# Altium schematic sheet LTE_SARA-R422-00B.SchDoc
size A4; SheetNumber: 2; SheetTotal: 10
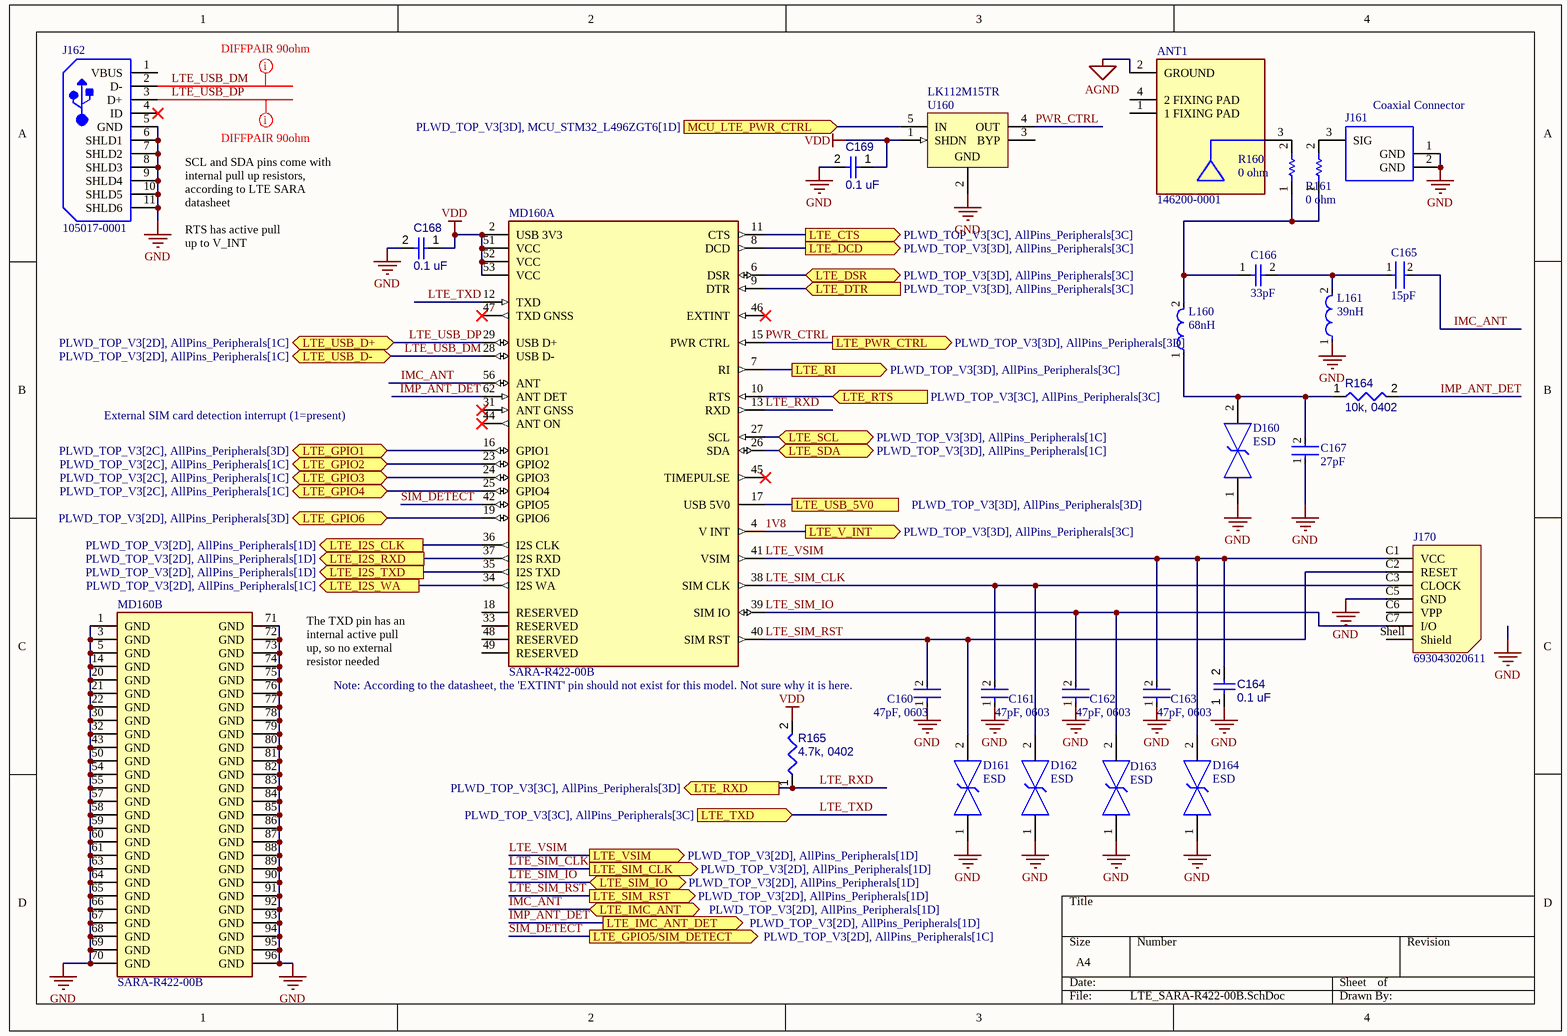
[diagram p0: LTE_SARA-R422-00B.SchDoc]

## Parts
ANT1  146200-0001  [FP-146200-0001-MFG]
C160  47pF, 0603  [FP-C0603C-CF-MFG]
C161  47pF, 0603  [FP-C0603C-CF-MFG]
C162  47pF, 0603  [FP-C0603C-CF-MFG]
C163  47pF, 0603  [FP-C0603C-CF-MFG]
C164  0.1 uF  [CAPC1005X56X25LL10T15]
C165  15pF  [FP-0603-L_1_6_0_15-W_0_81-IPC_B]
C166  33pF  [CAPC1608X90X35NL15T15]
C167  27pF  [FP-C0603C-CF-MFG]
C168  0.1 uF  [CAPC1005X56X25LL10T15]
C169  0.1 uF  [CAPC1005X56X25LL10T15]
D160  ESD  [FP-PG-TSSLP-2-MFG]
D161  ESD  [FP-PG-TSSLP-2-MFG]
D162  ESD  [FP-PG-TSSLP-2-MFG]
D163  ESD  [FP-PG-TSSLP-2-MFG]
D164  ESD  [FP-PG-TSSLP-2-MFG]
J161  Coaxial Connector  [HRS-U.FL-R-SMT_V]
J162  105017-0001  [USB-MICRO-B_V]
J170  693043020611  [693043020611]
L160  68nH  [FP-LQW18AN_00-MFG]
L161  39nH  [FP-LQW18AN_00-MFG]
MD160  SARA-R422-00B  [FP-SARA-R422-00B-MFG]  (parts A,B of 2)
R160  0 ohm  [RESC1005X40X25LL05T10]
R161  0 ohm  [RESC1005X40X25LL05T10]
R164  10k, 0402  [RESC1005X40X25ML05T05]
R165  4.7k, 0402  [RESC0402(1005)_L]
U160  LK112M15TR  [SOT23-5L_L]

## Ports
LTE_CTS (out, see PLWD_TOP_V3[3C], AllPins_Peripherals[3C]), LTE_DCD (out, see PLWD_TOP_V3[3D], AllPins_Peripherals[3C]), LTE_DSR (bidir, see PLWD_TOP_V3[3D], AllPins_Peripherals[3C]), LTE_DTR (in, see PLWD_TOP_V3[3D], AllPins_Peripherals[3C]), LTE_GPIO1 (bidir, see PLWD_TOP_V3[2C], AllPins_Peripherals[3D]), LTE_GPIO2 (bidir, see PLWD_TOP_V3[2C], AllPins_Peripherals[1C]), LTE_GPIO3 (bidir, see PLWD_TOP_V3[2C], AllPins_Peripherals[1C]), LTE_GPIO4 (bidir, see PLWD_TOP_V3[2C], AllPins_Peripherals[1C]), LTE_GPIO5/SIM_DETECT (out, see PLWD_TOP_V3[2D], AllPins_Peripherals[1C]), LTE_GPIO6 (bidir, see PLWD_TOP_V3[2D], AllPins_Peripherals[3D]), LTE_I2S_CLK (out, see PLWD_TOP_V3[2D], AllPins_Peripherals[1D]), LTE_I2S_RXD (out, see PLWD_TOP_V3[2D], AllPins_Peripherals[1D]), LTE_I2S_TXD (out, see PLWD_TOP_V3[2D], AllPins_Peripherals[1D]), LTE_I2S_WA (out, see PLWD_TOP_V3[2D], AllPins_Peripherals[1C]), LTE_IMC_ANT (bidir, see PLWD_TOP_V3[2D], AllPins_Peripherals[1D]), LTE_IMC_ANT_DET (out, see PLWD_TOP_V3[2D], AllPins_Peripherals[1D]), LTE_PWR_CTRL (out, see PLWD_TOP_V3[3D], AllPins_Peripherals[3D]), LTE_RI (out, see PLWD_TOP_V3[3D], AllPins_Peripherals[3C]), LTE_RTS (in, see PLWD_TOP_V3[3C], AllPins_Peripherals[3C]), LTE_RXD (out, see PLWD_TOP_V3[3C], AllPins_Peripherals[3D]), LTE_SCL (bidir, see PLWD_TOP_V3[3D], AllPins_Peripherals[1C]), LTE_SDA (bidir, see PLWD_TOP_V3[3D], AllPins_Peripherals[1C]), LTE_SIM_CLK (out, see PLWD_TOP_V3[2D], AllPins_Peripherals[1D]), LTE_SIM_IO (bidir, see PLWD_TOP_V3[2D], AllPins_Peripherals[1D]), LTE_SIM_RST (out, see PLWD_TOP_V3[2D], AllPins_Peripherals[1D]), LTE_TXD (in, see PLWD_TOP_V3[3C], AllPins_Peripherals[3C]), LTE_USB_5V0 (see PLWD_TOP_V3[3D], AllPins_Peripherals[3D]), LTE_USB_D+ (bidir, see PLWD_TOP_V3[2D], AllPins_Peripherals[1C]), LTE_USB_D- (bidir, see PLWD_TOP_V3[2D], AllPins_Peripherals[1C]), LTE_V_INT (out, see PLWD_TOP_V3[3D], AllPins_Peripherals[3C]), LTE_VSIM (out, see PLWD_TOP_V3[2D], AllPins_Peripherals[1D]), MCU_LTE_PWR_CTRL (in, see PLWD_TOP_V3[3D], MCU_STM32_L496ZGT6[1D])

## Nets
AGND: ANT1.2(GROUND)
GND: C160.1 C161.1 C162.1 C163.1 C164.1 C167.1 C168.2 C169.2 D160.1 D161.1 D162.1 D163.1 D164.1 J161.1(GND) J161.2(GND) J162.5(GND) J162.6(SHLD1) J162.7(SHLD2) J162.8(SHLD3) J162.9(SHLD4) J162.10(SHLD5) J162.11(SHLD6) J170.C5(GND) L161.1 MD160.1(GND) MD160.3(GND) MD160.5(GND) MD160.14(GND) MD160.20(GND) MD160.21(GND) MD160.22(GND) MD160.30(GND) MD160.32(GND) MD160.43(GND) MD160.50(GND) MD160.54(GND) MD160.55(GND) MD160.57(GND) MD160.58(GND) MD160.59(GND) MD160.60(GND) MD160.61(GND) MD160.63(GND) MD160.64(GND) MD160.65(GND) MD160.66(GND) MD160.67(GND) MD160.68(GND) MD160.69(GND) MD160.70(GND) MD160.71(GND) MD160.72(GND) MD160.73(GND) MD160.74(GND) MD160.75(GND) MD160.76(GND) MD160.77(GND) MD160.78(GND) MD160.79(GND) MD160.80(GND) MD160.81(GND) MD160.82(GND) MD160.83(GND) MD160.84(GND) MD160.85(GND) MD160.86(GND) MD160.87(GND) MD160.88(GND) MD160.89(GND) MD160.90(GND) MD160.91(GND) MD160.92(GND) MD160.93(GND) MD160.94(GND) MD160.95(GND) MD160.96(GND) U160.2(GND)
VDD: C168.1 C169.1 MD160.2(USB_3V3) MD160.51(VCC) MD160.52(VCC) MD160.53(VCC) R165.2 U160.1(SHDN)
1V8: MD160.4(V_INT) ; port LTE_V_INT
IMC_ANT: C165.2 MD160.56(ANT) ; port LTE_IMC_ANT
IMP_ANT_DET: MD160.62(ANT_DET) R164.2 ; port LTE_IMC_ANT_DET
LTE_CTS: MD160.11(CTS) ; port LTE_CTS
LTE_DCD: MD160.8(DCD) ; port LTE_DCD
LTE_DSR: MD160.6(DSR) ; port LTE_DSR
LTE_DTR: MD160.9(DTR) ; port LTE_DTR
LTE_GPIO1: MD160.16(GPIO1) ; port LTE_GPIO1
LTE_GPIO2: MD160.23(GPIO2) ; port LTE_GPIO2
LTE_GPIO3: MD160.24(GPIO3) ; port LTE_GPIO3
LTE_GPIO4: MD160.25(GPIO4) ; port LTE_GPIO4
LTE_GPIO6: MD160.19(GPIO6) ; port LTE_GPIO6
LTE_I2S_CLK: MD160.36(I2S_CLK) ; port LTE_I2S_CLK
LTE_I2S_RXD: MD160.37(I2S_RXD) ; port LTE_I2S_RXD
LTE_I2S_TXD: MD160.35(I2S_TXD) ; port LTE_I2S_TXD
LTE_I2S_WA: MD160.34(I2S_WA) ; port LTE_I2S_WA
LTE_RI: MD160.7(RI) ; port LTE_RI
LTE_RTS: MD160.10(RTS) ; port LTE_RTS
LTE_RXD: MD160.13(RXD) R165.1 ; port LTE_RXD
LTE_SCL: MD160.27(SCL) ; port LTE_SCL
LTE_SDA: MD160.26(SDA) ; port LTE_SDA
LTE_SIM_CLK: C161.2 D162.2 J170.C3(CLOCK) MD160.38(SIM_CLK) ; port LTE_SIM_CLK
LTE_SIM_IO: C162.2 D163.2 J170.C7(I/O) MD160.39(SIM_IO) ; port LTE_SIM_IO
LTE_SIM_RST: C160.2 D161.2 J170.C2(RESET) MD160.40(SIM_RST) ; port LTE_SIM_RST
LTE_TXD: MD160.12(TXD) ; port LTE_TXD
LTE_USB_5V0: MD160.17(USB_5V0) ; port LTE_USB_5V0
LTE_USB_DM: J162.2(D-) MD160.28(USB_D-) ; port LTE_USB_D-
LTE_USB_DP: J162.3(D+) MD160.29(USB_D+) ; port LTE_USB_D+
LTE_VSIM: C163.2 C164.2 D164.2 J170.C1(VCC) MD160.41(VSIM) ; port LTE_VSIM
MCU_LTE_PWR_CTRL: U160.5(IN) ; port MCU_LTE_PWR_CTRL
PWR_CTRL: MD160.15(PWR_CTRL) U160.4(OUT) ; port LTE_PWR_CTRL
SIM_DETECT: MD160.42(GPIO5) ; port LTE_GPIO5/SIM_DETECT
NetANT1_3: ANT1.3(FEEDING) R160.2
NetC165_1: C165.1 C166.2 L161.2
NetC166_1: C166.1 L160.2 R160.1 R161.1
NetC167_2: C167.2 D160.2 L160.1 R164.1
NetJ161_3: J161.3(SIG) R161.2

Not connected (* = marked no-connect by the designer): ANT1 1(1_FIXING_PAD) 4(2_FIXING_PAD); J162 1(VBUS) 4(ID)*; J170 C6(VPP) Shell(Shield); MD160 18(RESERVED) 31(ANT_GNSS)* 33(RESERVED) 44(ANT_ON)* 45(TIMEPULSE)* 46(EXTINT)* 47(TXD_GNSS)* 48(RESERVED) 49(RESERVED); U160 3(BYP)

## Layout directives
mark named DIFFPAIR 90ohm: LTE_USB_DM, LTE_USB_DP

## Notes on the sheet
- SCL and SDA pins come with internal pull up resistors, according to LTE SARA datasheet
- RTS has active pull up to V_INT
- External SIM card detection interrupt (1=present)
- The TXD pin has an internal active pull up, so no external resistor needed
- (near C160) Note: According to the datasheet, the 'EXTINT' pin should not exist for this model. Not sure why it is here.

## Library data of the parts
ANT1 = CMP-04721-000002-1: RF ANT 829MHZ/2.2GHZ CHIP SLD; Manufacturer: Molex; Number Of Bands: 2; Gain: 3.8dB; Max Frequency: 2700MHz; Bandwidth: 280/990MHz; Return Loss: -5dB; Automotive: No; ComponentLink2URL: https://www.molex.com/webdocs/datasheets/pdf/en-us/1462000001_ANTENNAS.pdf; Device Class L1: Integrated Circuits (ICs); RoHS: TRUE; Footprint Url: https://www.molex.com/pdm_docs/sd/1462000001_sd.pdf; Device Class L3: RF Antennas; Height: 5.3mm; Package: 146200-0001; Manufacturer Part Number: 146200-0001; Category: Ant; ComponentLink2Description: Datasheet; Digikey Description: RF ANT 829MHZ/2.2GHZ CHIP SLD; Device Class L2: RF Semiconductors and Devices; Mouser Description: Antenna; RF; 3.8dBi; f: 1710÷2700MHz, 698÷960MHz; Mounting: SMD; Lead Free: Yes; Octopart: https://octopart.com/146200-0001-molex-75347041
C160-C163 = CMP-2006-03321-2: CAP CER 47PF 100V 5% NP0; Manufacturer: KEMET; Manufacturer Part Number: C0603C470J1GACTU; Temperature Characteristic: C0G; Temperature Coefficient: 30ppm/°C; Automotive Grade: Grade 1; Material: Ceramic; Tolerance: 0.05; Digikey Description: CAP CER 47PF 100V 5% NP0 0603; Value: 47 pF; Category: Cap; Device Class L2: Capacitors; Device Class L1: Passive Components; Package: C0603C-CF; Octopart: https://octopart.com/c0603c470j1gactu-kemet-3768219; Lead Free: Yes; Temperature Range High: +125°C; Device Class L3: Ceramic Capacitors; Height: 0.87mm; Temperature: -55°C to +125°C; Mouser Description: Multilayer Ceramic Capacitors MLCC - SMD/SMT 100volts 47pF C0G 5%; Automotive: Yes; Capacitance: 47 pF; RoHS: TRUE; ComponentLink2URL: https://api.kemet.com/component-edge/download/datasheet/C0603C100J5GACAUTO.pdf; Voltage Rating: 100 V; ComponentLink2Description: Datasheet; Temperature Range Low: -55°C
C164 C168 C169 = CMP-001-00001-6: Chip Capacitor, 0.1 uF, +/- 5%, 16 V, 0402 (1005 Metric); Value: 100nF; Capacitor Type: Ceramic; Voltage Rating: 16V; Min Operating Temperature: -55°C; Pins: 2; Case/Package: 0402; Max Operating Temperature: 125°C; Mounting Technology: SM; RoHS Compliant: True; Tolerance: 5%
C165 = CMP-04427-007118-1: General Purpose Ceramic Capacitor, 0603, 15pF, 1%, NP0, 30ppm/°C, 50V; Dielectric: C0G; Case Code (Metric): 1608; Mount: Surface Mount; Thickness: 0.035inch; Width: 0.032inch; Package Quantity: 4000; Packaging: Tape and Reel; Capacitance: 15pF; Length: 1.6mm; Case/Package: 0603; Voltage Rating (DC): 50V; Construction: Flat; Min Operating Temperature: -55°C; Radiation Hardening: No; RoHS Compliant: Yes; Tolerance: 1%; Series: 0603; Case Code (Imperial): 0603; Depth: 0.81mm; Max Operating Temperature: 125°C; Voltage Rating: 50V; Termination: SMD/SMT
C166 = CMP-2006-04030-1: Manufacturer: AVX Interconnect / Elco; Part Number: 06031A330FAT2A
C167 = CMP-2006-03479-2: CAP CER 27PF 50V 1% NP0 0603; Manufacturer: KEMET; Manufacturer Part Number: C0603C270F5GACTU; Automotive Grade: Grade 1; Temperature Coefficient: 30ppm/°C; Tolerance: 0.01; Temperature Characteristic: C0G; Material: Ceramic; Temperature: -55°C to +125°C; ComponentLink2URL: https://api.kemet.com/component-edge/download/datasheet/C0603C100J5GACAUTO.pdf; Category: Cap; Device Class L1: Passive Components; Mouser Description: Multilayer Ceramic Capacitors MLCC - SMD/SMT 50volts 27pF C0G 1%; Lead Free: Yes; Device Class L2: Capacitors; Digikey Description: CAP CER 27PF 50V 1% NP0 0603; Voltage Rating: 50 V; Value: 27 pF; Automotive: Yes; Temperature Range Low: -55°C; Device Class L3: Ceramic Capacitors; Height: 0.87mm; Package: C0603C-CF; RoHS: TRUE; ComponentLink2Description: Datasheet; Octopart: https://octopart.com/c0603c270f5gactu-kemet-9143570; Capacitance: 27 pF; Temperature Range High: +125°C
D160-D164 = CMP-32928-000008-1: TVS DIODE 5.5V 30V TSSLP-2-4; Power Line Protection: No; Element Configuration: Single; Number of Bidirectional Channels: 1; Min Breakdown Voltage: 7.3V; Capacitance: 0.2pF; Direction: Bidirectional; Leakage Current: 50nA; Peak Pulse Current: 2A; Composition: Zener; Case/Package: SMD/SMT; Max Operating Temperature: 125°C; Working Voltage: 5.5V; Packaging: Tape and Reel; Length: 0.62mm; Reverse Standoff Voltage: 5.5V; Clamping Voltage: 30V; Min Operating Temperature: -55°C; Lead Free: Lead Free; Halogen Free: Halogen Free; Mount: Surface Mount; Radiation Hardening: No; Package Quantity: 15000; Depth: 0.32mm; Number of Pins: 2
J161 = CMP-002-00035-2: Ultra Small Surface Mount Coaxial Connector, 50 Ohm, -40 to 90 degC, 3-Pin SMD, RoHS, Tape and Reel; Manufacturer: Hirose Electric; Impedance: 50Ohm; Connector Type: RF&Coax; Max Operating Temperature: 90°C; Contact Material: Brass; Packaging: TapeandReel; Mounting Technology: SM; Package Quantity: 2500; Min Operating Temperature: -40°C; Contact Plating: Gold; RoHS Compliant: True; Datasheet Version: Aug-16; Package Description: 3-Pin Surface Mount Device, Body 2.6 x 2.6 mm; Datasheet URL: https://www.hirose.com/product/en/download_file/key_name/U.FL/category/Catalog/doc_file_id/31697/?file_category_id=4&item_id=15&is_series=1; Package Reference: U.FL-R-SMT; Fastening Type: Snap; Resistance: 50Ohm; Manufacturer URL: https://www.hirose.com; Case/Package: U.FL-R-SMT
J162 = CMP-2000-05827-1: Micro-USB B Receptacle, Right Angle, Bottom Mount, Surface Mount, with Solder Tabs, -30 to 85 degC, 5-Pin USB, RoHS, Tape and Reel; Manufacturer: Molex; Featured Product: Micro-USBConnectorsUSBConnectors; Other Names: WM1399DKR; Package Version: Rev. F, 12/2012; Number of Contacts: 5; Connector Type: USB-microB; Catalog Drawings: 1050170001; 3D Model: 105017-0001.stp; Mating Products: WM17145-ND-CABLEMICROUSBBTOSTDA1.0MWM17147-ND-CABLEMICROUSBBTOSTDA2.0MWM17146-ND-CABLEMICROUSBBTOSTDA1.5M; PCN Assembly/Origin: ResinSupplier21/Oct/2015; Voltage - Max: 30V; Online Catalog: Molex-MicroUSB; Manufacturer URL: http://www.molex.com/; Package Description: 5-Leads USB, Micro B, Body 7.5 x 5 mm, Pitch 0.65 mm; Datasheet URL: http://www.molex.com/elqNow/elqRedir.htm?ref=http://www.molex.com/webdocs/datasheets/pdf/en-us/1050170001_IO_CONNECTORS.pdf; Ingress Protection: -; Datasheet Version: 03/2016; Mounting Type: BoardCutout,SurfaceMount,RightAngle; Circuits: 5; Standard Package: 1; Package Reference: MICRO-B; Package URL: http://www.molex.com/pdm_docs/sd/1050170001_sd.pdf; Category: Connectors,Interconnects; Series: -; RoHS Information: 1050170001CertofCompliance; Features: Shielded,SolderRetention; Family: USB,DVI,HDMIConnectors; Specifications: -; Gender: Receptacle; Packaging: Digi-Reel®; Mounting Technology: SurfaceMount
J170 = CMP-1502-00157-2: NexarPartId: 52645179; Number of Positions: 6; Insulation Resistance: 500MΩ; Current Rating: 1A; Operating Supply Voltage: 15V; Connector Type: Connector; Number of Pins: 6; Min Operating Temperature: -25°C; Height: 1.3mm; RoHS: Compliant; Features: Shielded; Mount: Surface Mount; Voltage Rating: 15V; Contact Material: Gold; Contact Plating: Gold; REACH SVHC: Unknown; Lead Free: Lead Free; Number of Contacts: 6; Packaging: Tape and Reel; Max Operating Temperature: 85°C
L160 = CMP-06042-005646-1: Wire Wound RF Inductor 68nH ±2% 340mA 0.38Ω 0603 (1608); Q Factor: 38; Shielding: Unshielded; Series Resistance: 380mR; Test Frequency: 100MHz; Core Material: Non-Magnetic; Self Resonant Frequency: 2.2GHz; Current: 220mA; Number of Pins: 2; Height: 0.8mm; Height - Seated (Max): 0.039inch; Max DC Current: 340mA; Inductance: 68nH; Tolerance: 2%; Packaging: Tape and Reel; Mount: Surface Mount; Lead Free: Lead Free; Width: 0.8mm; Case/Package: 0603; DC Current: 340mA; Depth: 1mm; Min Operating Temperature: -55°C; Military Standard: Not; Package Quantity: 1; REACH SVHC: No SVHC; Length: 1.6mm; DC Resistance (DCR): 380mR; Current Rating: 340mA; Weight: 0.000106oz; Inductance Tolerance: 2%; Max Operating Temperature: 125°C; Termination: SMD/SMT; Case Code (Metric): 1608; Case Code (Imperial): 0603; Resistor Type: Wirewound
L161 = CMP-06042-008736-1: Wire Wound RF Inductor 39nH ±2% 400mA 0.26Ω 0603 (1608); Core Material: Non-Magnetic; Test Frequency: 100MHz; Shielding: Unshielded; Q Factor: 40; Self Resonant Frequency: 2.8GHz; Current: 370mA; DC Resistance (DCR): 260mR; Package Quantity: 4000; Case/Package: 0603; Resistor Type: Wirewound; Height - Seated (Max): 0.039inch; Lead Free: Lead Free; Min Operating Temperature: -55°C; Case Code (Imperial): 0603; Radiation Hardening: No; Max Operating Temperature: 125°C; Military Standard: Not; Depth: 1mm; Height: 0.8mm; Inductance: 39nH; Case Code (Metric): 1608; Termination: SMD/SMT; Current Rating: 400mA; Max DC Current: 400mA; Tolerance: 2%; Width: 0.031inch; Series Resistance: 260mR; Weight: 0.000106oz; DC Current: 400mA; Length: 1.6mm; Packaging: Tape and Reel; Mount: Surface Mount
MD160 = CMP-207130-000019-1: RF TXRX CELL 4G LTE NB-IOT EGPRS
R160 R161 = CMP-2002-06455-1: Manufacturer: Panasonic; Part Number: ERJ-S020R00X
R164 = CMP-009-00015-5: Chip Resistor, 10 KOhm, +/- 1%, 0.1 W, -55 to 155 degC, 0402 (1005 Metric); Voltage Rating: 50V; Power: 100mW; Case/Package: 0402; Value: 10k; RoHS Compliant: True; Min Operating Temperature: -55°C; Mounting Technology: SM; Tolerance: 1%; Max Operating Temperature: 155°C; Pins: 2
R165 = CMP-009-00158-3: Chip Resistor, 4,7 kOhms, +/-1 %, 63 mW, -55 to 155 degC, 0402; Power: 63mW; Tolerance: 1%; Max Operating Temperature: 155°C; Pins: 2; Value: 4.7k; Min Operating Temperature: -55°C; Case/Package: 0402
U160 = CMP-0244-00381-1: Low Noise Low Drop Voltage Regulator with Shutdown Function, 1.5V, 5-Pin SOT23-5L, Tape and Reel; ComponentLink2Description: Datasheet; DatasheetVersion: 28/02/2011; PackageReference: SOT23-5L; ComponentLink1Description: Manufacturer URL; PackageVersion: 1/01/2008; PackageDescription: 5-Pin SOT-23 Package, 2.9 x 1.6 mm Body, 0.95 mm Pitch, 2.8 mm Lead Span; ComponentLink1URL: http://www.st.com; ComponentLink2URL: http://www.st.com/internet/com/TECHNICAL_RESOURCES/TECHNICAL_LITERATURE/DATASHEET/CD00002190.pdf